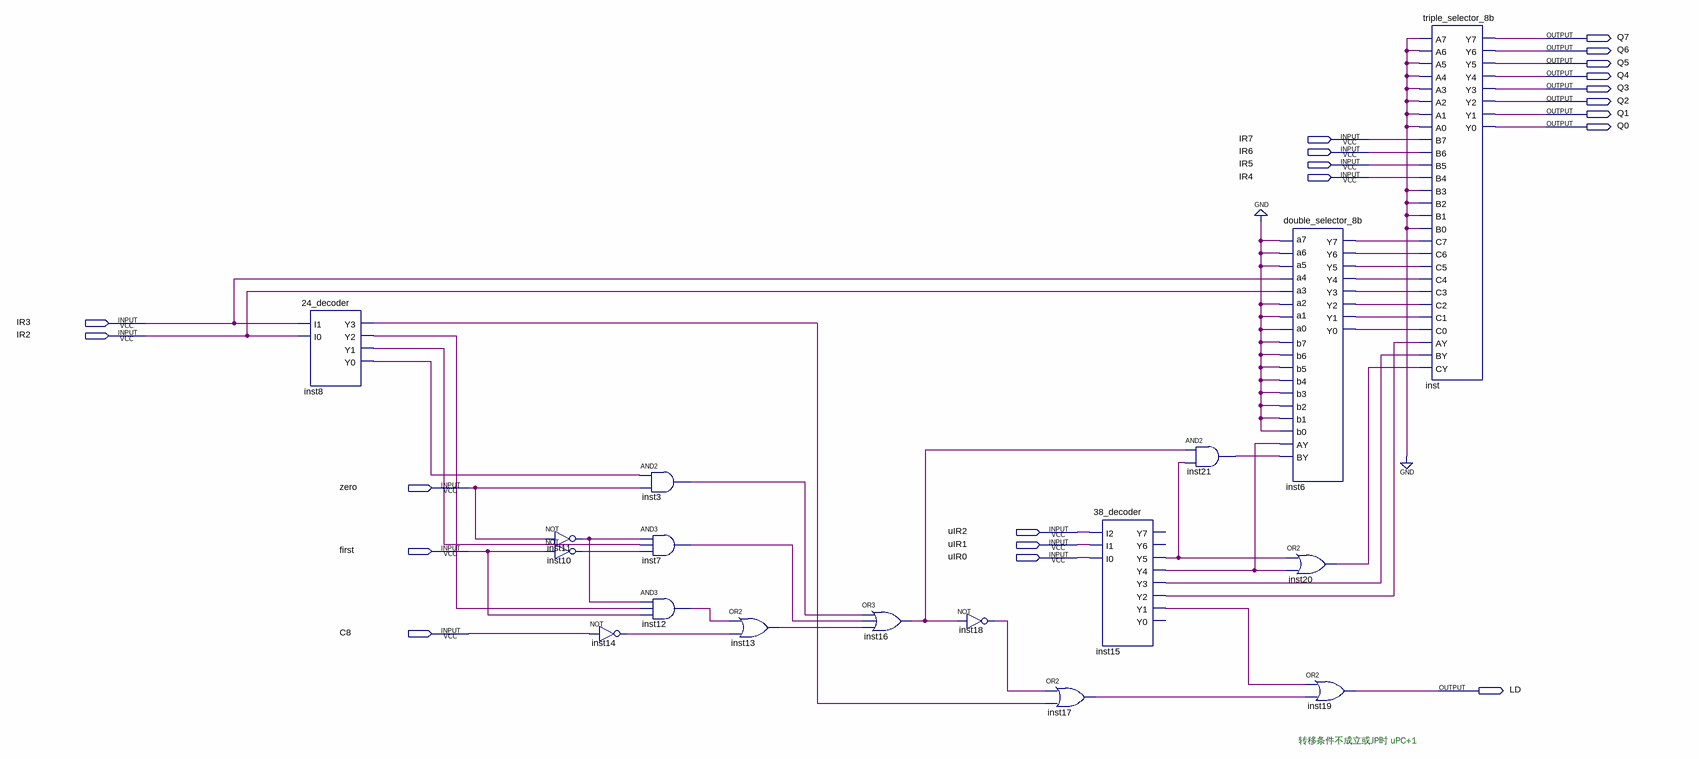
[diagram p0: schematic sheet]
// Quartus schematic micro_address_generator.bdf as structural Verilog: 17 symbols, 21 pins
module micro_address_generator (
  input  IR7,
  input  IR6,
  input  IR5,
  input  IR4,
  input  IR3,
  input  IR2,
  input  zero,
  input  uIR2,
  input  uIR1,
  input  first,
  input  uIR0,
  input  C8,
  output Q7,
  output Q6,
  output Q5,
  output Q4,
  output Q3,
  output Q2,
  output Q1,
  output Q0,
  output LD
);

  wire inst3_out, inst6_y0, inst6_y1, inst6_y2, inst6_y3, inst6_y4, inst6_y5, inst6_y6, inst6_y7, inst7_out,
       inst8_y0, inst8_y1, inst8_y2, inst8_y3, inst10_out, inst11_out, inst12_out, inst13_out, inst14_out,
       inst15_y1, inst15_y2, inst15_y3, inst15_y4, inst15_y5, inst16_out, inst17_out, inst18_out, inst20_out,
       inst21_out;

  \24_decoder  inst8 (.I1(IR3), .I0(IR2), .Y3(inst8_y3), .Y2(inst8_y2), .Y1(inst8_y1), .Y0(inst8_y0));
  not inst11 (inst11_out, zero);
  not inst10 (inst10_out, first);
  not inst14 (inst14_out, C8);
  and inst3 (inst3_out, inst8_y0, zero);
  and inst7 (inst7_out, inst11_out, inst8_y1, inst10_out);
  and inst12 (inst12_out, inst11_out, inst8_y2, first);
  or inst13 (inst13_out, inst12_out, inst14_out);
  or inst16 (inst16_out, inst3_out, inst7_out, inst13_out);
  not inst18 (inst18_out, inst16_out);
  or inst17 (inst17_out, inst18_out, inst8_y3);
  \38_decoder  inst15 (
    .I2(uIR2), .I1(uIR1), .I0(uIR0), .Y5(inst15_y5), .Y4(inst15_y4), .Y3(inst15_y3), .Y2(inst15_y2),
    .Y1(inst15_y1));  // open: Y7, Y6, Y0
  and inst21 (inst21_out, inst16_out, inst15_y5);
  double_selector_8b inst6 (
    .a0(1'b0), .a1(1'b0), .a2(1'b0), .a3(IR2), .a4(IR3), .a5(1'b0), .a6(1'b0), .a7(1'b0), .b0(1'b0),
    .b1(1'b0), .b2(1'b0), .b3(1'b0), .b4(1'b0), .b5(1'b0), .b6(1'b0), .b7(1'b0), .AY(inst15_y4),
    .BY(inst21_out), .Y0(inst6_y0), .Y1(inst6_y1), .Y2(inst6_y2), .Y3(inst6_y3), .Y4(inst6_y4),
    .Y5(inst6_y5), .Y6(inst6_y6), .Y7(inst6_y7));
  or inst20 (inst20_out, inst15_y5, inst15_y4);
  or inst19 (LD, inst15_y1, inst17_out);
  triple_selector_8b inst (
    .A7(1'b0), .B7(IR7), .C7(inst6_y7), .A6(1'b0), .B6(IR6), .C6(inst6_y6), .A5(1'b0), .B5(IR5),
    .C5(inst6_y5), .A4(1'b0), .B4(IR4), .C4(inst6_y4), .A3(1'b0), .B3(1'b0), .C3(inst6_y3), .A2(1'b0),
    .B2(1'b0), .C2(inst6_y2), .A1(1'b0), .B1(1'b0), .C1(inst6_y1), .A0(1'b0), .B0(1'b0), .C0(inst6_y0),
    .AY(inst15_y2), .BY(inst15_y3), .CY(inst20_out), .Y7(Q7), .Y6(Q6), .Y5(Q5), .Y4(Q4), .Y3(Q3), .Y2(Q2),
    .Y1(Q1), .Y0(Q0));

  // Notes on the sheet:
  //   转移条件不成立或JP时 uPC+1
endmodule
